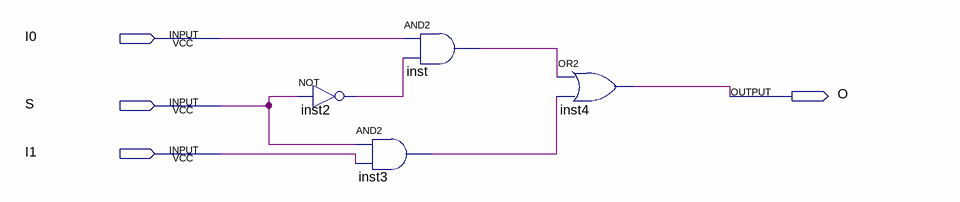
[diagram p0: schematic sheet]
// Quartus schematic mux2to1.bdf as structural Verilog: 4 symbols, 4 pins
module mux2to1 (
  input  I0,
  input  S,
  input  I1,
  output O
);

  wire inst2_out, inst3_out, inst_out;

  not inst2 (inst2_out, S);
  and inst3 (inst3_out, S, I1);
  and inst (inst_out, I0, inst2_out);
  or inst4 (O, inst_out, inst3_out);
endmodule
